# EAGLE design R220J (EAGLE 6.6.0)
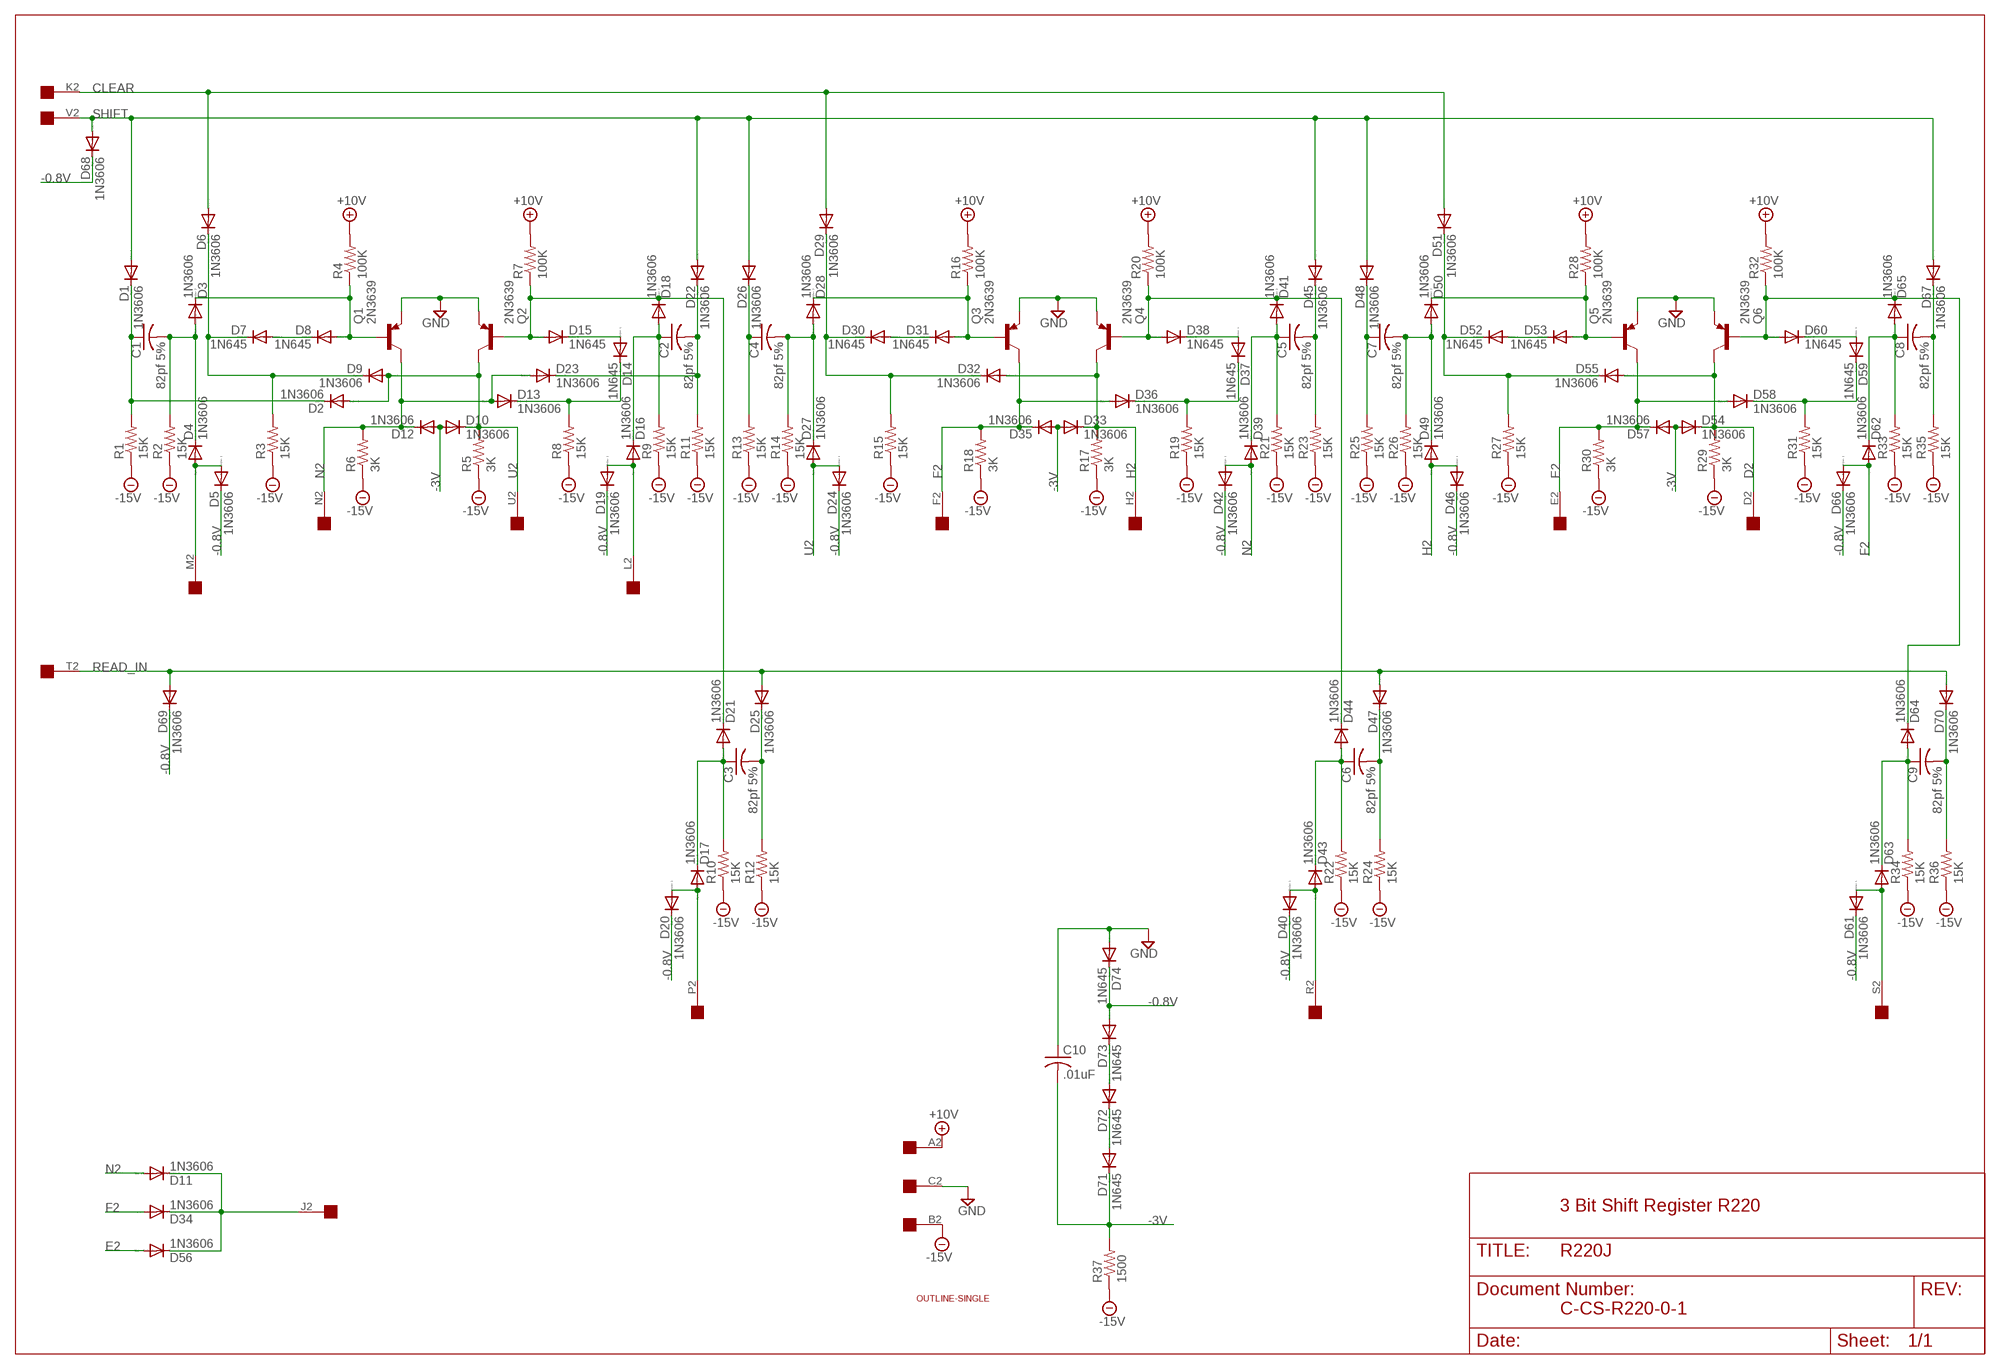
[diagram p0: schematic, sheet 1]

## Parts
C1  82pf 5%  C-US050-025X075  [C050-025X075]
C2  82pf 5%  C-US050-025X075  [C050-025X075]
C3  82pf 5%  C-US050-025X075  [C050-025X075]
C4  82pf 5%  C-US050-025X075  [C050-025X075]
C5  82pf 5%  C-US050-025X075  [C050-025X075]
C6  82pf 5%  C-US050-025X075  [C050-025X075]
C7  82pf 5%  C-US050-025X075  [C050-025X075]
C8  82pf 5%  C-US050-025X075  [C050-025X075]
C9  82pf 5%  C-US050-025X075  [C050-025X075]
C10  .01uF  C-US050-025X075  [C050-025X075]
D1  1N3606  1N4148DO35-10  [DO35-10]
D2  1N3606  1N4148DO35-10  [DO35-10]
D3  1N3606  1N4148DO35-10  [DO35-10]
D4  1N3606  1N4148DO35-10  [DO35-10]
D5  1N3606  1N4148DO35-10  [DO35-10]
D6  1N3606  1N4148DO35-10  [DO35-10]
D7  1N645  1N4148DO35-10  [DO35-10]
D8  1N645  1N4148DO35-10  [DO35-10]
D9  1N3606  1N4148DO35-10  [DO35-10]
D10  1N3606  1N4148DO35-10  [DO35-10]
D11  1N3606  1N4148DO35-10  [DO35-10]
D12  1N3606  1N4148DO35-10  [DO35-10]
D13  1N3606  1N4148DO35-10  [DO35-10]
D14  1N645  1N4148DO35-10  [DO35-10]
D15  1N645  1N4148DO35-10  [DO35-10]
D16  1N3606  1N4148DO35-10  [DO35-10]
D17  1N3606  1N4148DO35-10  [DO35-10]
D18  1N3606  1N4148DO35-10  [DO35-10]
D19  1N3606  1N4148DO35-10  [DO35-10]
D20  1N3606  1N4148DO35-10  [DO35-10]
D21  1N3606  1N4148DO35-10  [DO35-10]
D22  1N3606  1N4148DO35-10  [DO35-10]
D23  1N3606  1N4148DO35-10  [DO35-10]
D24  1N3606  1N4148DO35-10  [DO35-10]
D25  1N3606  1N4148DO35-10  [DO35-10]
D26  1N3606  1N4148DO35-10  [DO35-10]
D27  1N3606  1N4148DO35-10  [DO35-10]
D28  1N3606  1N4148DO35-10  [DO35-10]
D29  1N3606  1N4148DO35-10  [DO35-10]
D30  1N645  1N4148DO35-10  [DO35-10]
D31  1N645  1N4148DO35-10  [DO35-10]
D32  1N3606  1N4148DO35-10  [DO35-10]
D33  1N3606  1N4148DO35-10  [DO35-10]
D34  1N3606  1N4148DO35-10  [DO35-10]
D35  1N3606  1N4148DO35-10  [DO35-10]
D36  1N3606  1N4148DO35-10  [DO35-10]
D37  1N645  1N4148DO35-10  [DO35-10]
D38  1N645  1N4148DO35-10  [DO35-10]
D39  1N3606  1N4148DO35-10  [DO35-10]
D40  1N3606  1N4148DO35-10  [DO35-10]
D41  1N3606  1N4148DO35-10  [DO35-10]
D42  1N3606  1N4148DO35-10  [DO35-10]
D43  1N3606  1N4148DO35-10  [DO35-10]
D44  1N3606  1N4148DO35-10  [DO35-10]
D45  1N3606  1N4148DO35-10  [DO35-10]
D46  1N3606  1N4148DO35-10  [DO35-10]
D47  1N3606  1N4148DO35-10  [DO35-10]
D48  1N3606  1N4148DO35-10  [DO35-10]
D49  1N3606  1N4148DO35-10  [DO35-10]
D50  1N3606  1N4148DO35-10  [DO35-10]
D51  1N3606  1N4148DO35-10  [DO35-10]
D52  1N645  1N4148DO35-10  [DO35-10]
D53  1N645  1N4148DO35-10  [DO35-10]
D54  1N3606  1N4148DO35-10  [DO35-10]
D55  1N3606  1N4148DO35-10  [DO35-10]
D56  1N3606  1N4148DO35-10  [DO35-10]
D57  1N3606  1N4148DO35-10  [DO35-10]
D58  1N3606  1N4148DO35-10  [DO35-10]
D59  1N645  1N4148DO35-10  [DO35-10]
D60  1N645  1N4148DO35-10  [DO35-10]
D61  1N3606  1N4148DO35-10  [DO35-10]
D62  1N3606  1N4148DO35-10  [DO35-10]
D63  1N3606  1N4148DO35-10  [DO35-10]
D64  1N3606  1N4148DO35-10  [DO35-10]
D65  1N3606  1N4148DO35-10  [DO35-10]
D66  1N3606  1N4148DO35-10  [DO35-10]
D67  1N3606  1N4148DO35-10  [DO35-10]
D68  1N3606  1N4148DO35-10  [DO35-10]
D69  1N3606  1N4148DO35-10  [DO35-10]
D70  1N3606  1N4148DO35-10  [DO35-10]
D71  1N645  1N4148DO35-10  [DO35-10]
D72  1N645  1N4148DO35-10  [DO35-10]
D73  1N645  1N4148DO35-10  [DO35-10]
D74  1N645  1N4148DO35-10  [DO35-10]
Q1  2N3639  2N3637  [TO39]
Q2  2N3639  2N3637  [TO39]
Q3  2N3639  2N3637  [TO39]
Q4  2N3639  2N3637  [TO39]
Q5  2N3639  2N3637  [TO39]
Q6  2N3639  2N3637  [TO39]
R1  15K  R-US_0207/10  [0207/10]
R2  15K  R-US_0207/10  [0207/10]
R3  15K  R-US_0207/10  [0207/10]
R4  100K  R-US_0207/10  [0207/10]
R5  3K  R-US_0207/10  [0207/10]
R6  3K  R-US_0207/10  [0207/10]
R7  100K  R-US_0207/10  [0207/10]
R8  15K  R-US_0207/10  [0207/10]
R9  15K  R-US_0207/10  [0207/10]
R10  15K  R-US_0207/10  [0207/10]
R11  15K  R-US_0207/10  [0207/10]
R12  15K  R-US_0207/10  [0207/10]
R13  15K  R-US_0207/10  [0207/10]
R14  15K  R-US_0207/10  [0207/10]
R15  15K  R-US_0207/10  [0207/10]
R16  100K  R-US_0207/10  [0207/10]
R17  3K  R-US_0207/10  [0207/10]
R18  3K  R-US_0207/10  [0207/10]
R19  15K  R-US_0207/10  [0207/10]
R20  100K  R-US_0207/10  [0207/10]
R21  15K  R-US_0207/10  [0207/10]
R22  15K  R-US_0207/10  [0207/10]
R23  15K  R-US_0207/10  [0207/10]
R24  15K  R-US_0207/10  [0207/10]
R25  15K  R-US_0207/10  [0207/10]
R26  15K  R-US_0207/10  [0207/10]
R27  15K  R-US_0207/10  [0207/10]
R28  100K  R-US_0207/10  [0207/10]
R29  3K  R-US_0207/10  [0207/10]
R30  3K  R-US_0207/10  [0207/10]
R31  15K  R-US_0207/10  [0207/10]
R32  100K  R-US_0207/10  [0207/10]
R33  15K  R-US_0207/10  [0207/10]
R34  15K  R-US_0207/10  [0207/10]
R35  15K  R-US_0207/10  [0207/10]
R36  15K  R-US_0207/10  [0207/10]
R37  1500  R-US_0207/10  [0207/10]
U$1  OUTLINE-SINGLE  [SINGLE]
U$2  EDGE-1  [EDGE-CON1]

## Nets
+10V [Power]: R4.2 R7.2 R16.2 R20.2 R28.2 R32.2 U$2.A2
-0.8V [Power]: D5.C D19.C D20.C D24.C D40.C D42.C D46.C D61.C D66.C D68.C D69.C D73.A D74.C
-3V [Power]: C10.2 D10.A D12.A D33.A D35.A D54.A D57.A D71.C R37.2
-15V [Power]: R1.1 R2.1 R3.1 R5.1 R6.1 R8.1 R9.1 R10.1 R11.1 R12.1 R13.1 R14.1 R15.1 R17.1 R18.1 R19.1 R21.1 R22.1 R23.1 R24.1 R25.1 R26.1 R27.1 R29.1 R30.1 R31.1 R33.1 R34.1 R35.1 R36.1 R37.1 U$2.B2
CLEAR: D6.A D29.A D51.A U$2.K2
D2: D54.C D55.A Q6.3(C) R29.2 U$2.D2
E2: D56.A D57.C D58.A Q5.3(C) R30.2 U$2.E2
F2: D34.A D35.C D36.A D62.A D66.A Q3.3(C) R18.2 U$2.F2
GND [Power]: C10.1 D74.A Q1.1(E) Q2.1(E) Q3.1(E) Q4.1(E) Q5.1(E) Q6.1(E) U$2.C2
H2: D32.A D33.C D46.A D49.A Q4.3(C) R17.2 U$2.H2
N2: D11.A D12.C D13.A D23.A D39.A D42.A Q1.3(C) R6.2 U$2.N2
N$1: D30.A D31.C
N$2: C2.2 D22.C D23.C R11.2
N$3: D29.C D30.C D32.C R15.2
N$4: C1.1 D1.C D2.C R1.2
N$6: D14.A D15.C
N$7: C1.2 D3.A D4.C R2.2
N$8: C2.1 D16.C D18.A R9.2
N$9: D6.C D7.C D9.C R3.2
N$10: D4.A D5.A U$2.M2
N$11: D28.C D31.A Q3.2(B) R16.1
N$12: D13.C D14.C R8.2
N$13: D37.A D38.C
N$14: D3.C D8.A Q1.2(B) R4.1
N$15: D38.A D41.C D44.C Q4.2(B) R20.1
N$16: D36.C D37.C R19.2
N$17: D15.A D18.C D21.C Q2.2(B) R7.1
N$18: C4.1 D26.C R13.2
N$19: C4.2 D27.C D28.A R14.2
N$22: C5.1 D39.C D41.A R21.2
N$23: D7.A D8.C
N$24: D11.C D34.C D56.C U$2.J2
N$25: C5.2 D45.C R23.2
N$27: D52.A D53.C
N$28: D51.C D52.C D55.C R27.2
N$29: D50.C D53.A Q5.2(B) R28.1
N$30: D59.A D60.C
N$31: D60.A D64.C D65.C Q6.2(B) R32.1
N$32: D16.A D19.A U$2.L2
N$33: D58.C D59.C R31.2
N$34: C7.1 D48.C R25.2
N$35: C7.2 D49.C D50.A R26.2
N$36: D71.A D72.C
N$39: C8.1 D62.C D65.A R33.2
N$40: C8.2 D67.C R35.2
N$41: D72.A D73.C
N$43: C3.1 D17.C D21.A R10.2
N$44: C3.2 D25.C R12.2
N$46: C6.1 D43.C D44.A R22.2
N$47: C6.2 D47.C R24.2
N$50: C9.1 D63.C D64.A R34.2
N$51: C9.2 D70.C R36.2
P2: D17.A D20.A U$2.P2
R2: D40.A D43.A U$2.R2
READ_IN: D25.A D47.A D69.A D70.A U$2.T2
S2: D61.A D63.A U$2.S2
SHIFT: D1.A D22.A D26.A D45.A D48.A D67.A D68.A U$2.V2
U2: D2.A D9.A D10.C D24.A D27.A Q2.3(C) R5.2 U$2.U2

## Notes on the sheet
- 3 Bit Shift Register R220
- C-CS-R220-0-1

## Library data of the parts
C1-C10 = rcl:C-US: CAPACITOR, American symbol
D1-D74 = diode:1N4148: DIODE high speed (Philips)
Q1-Q6 = transistor-pnp:2N3637*: PNP Transistror
R1-R37 = rcl:R-US_: RESISTOR, American symbol
U$1 = dec-con:OUTLINE-*: Board outlines for DEC boards.
U$2 = dec-con:EDGE-1: Single-Sided DEC Edge Connector -- (side 2)

## Net classes
1 Power: width 0.813 mm

## Board
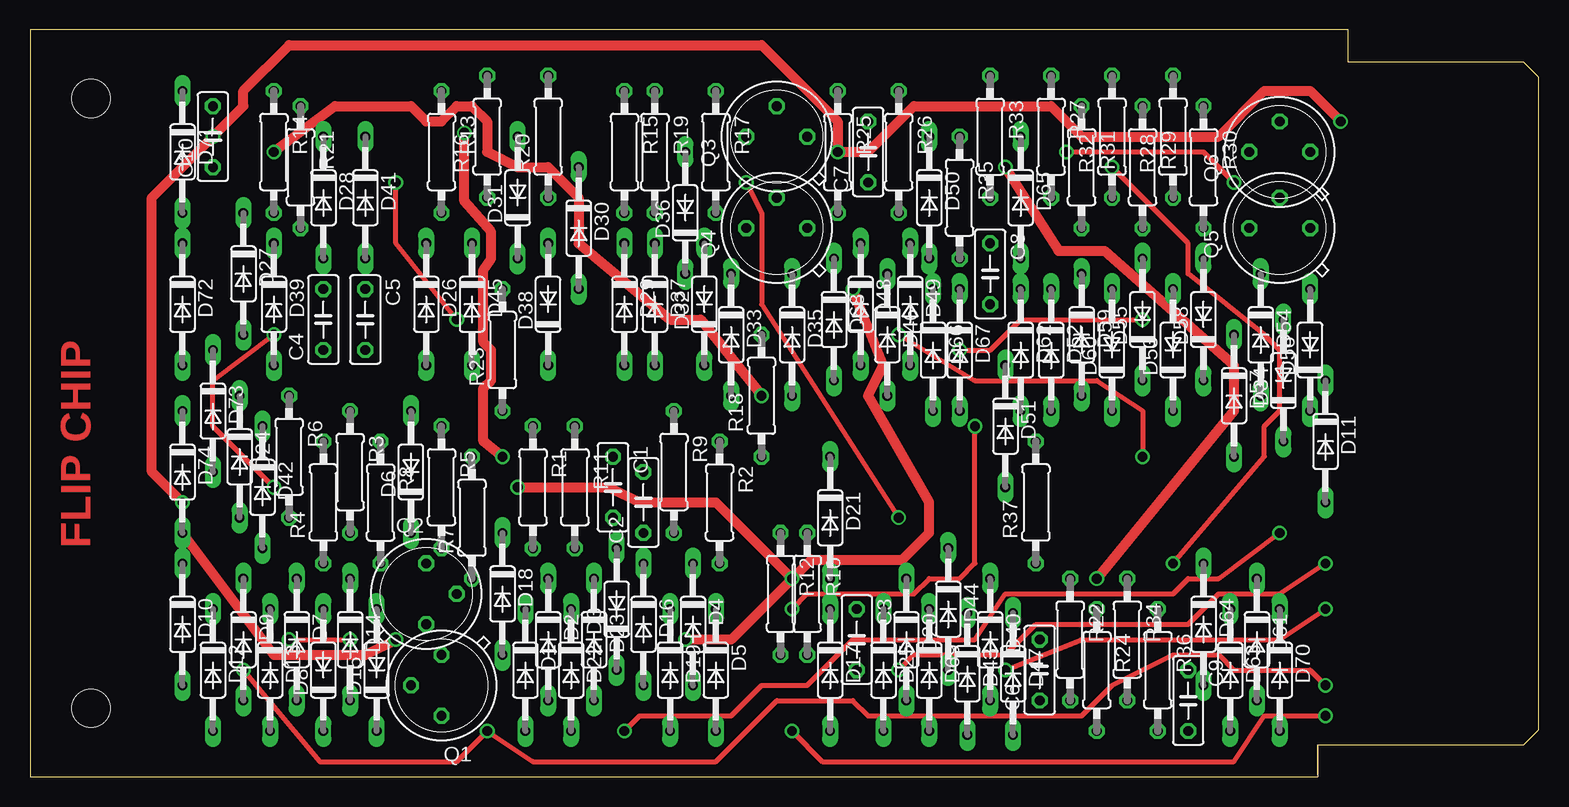
[diagram p1: board, top side]
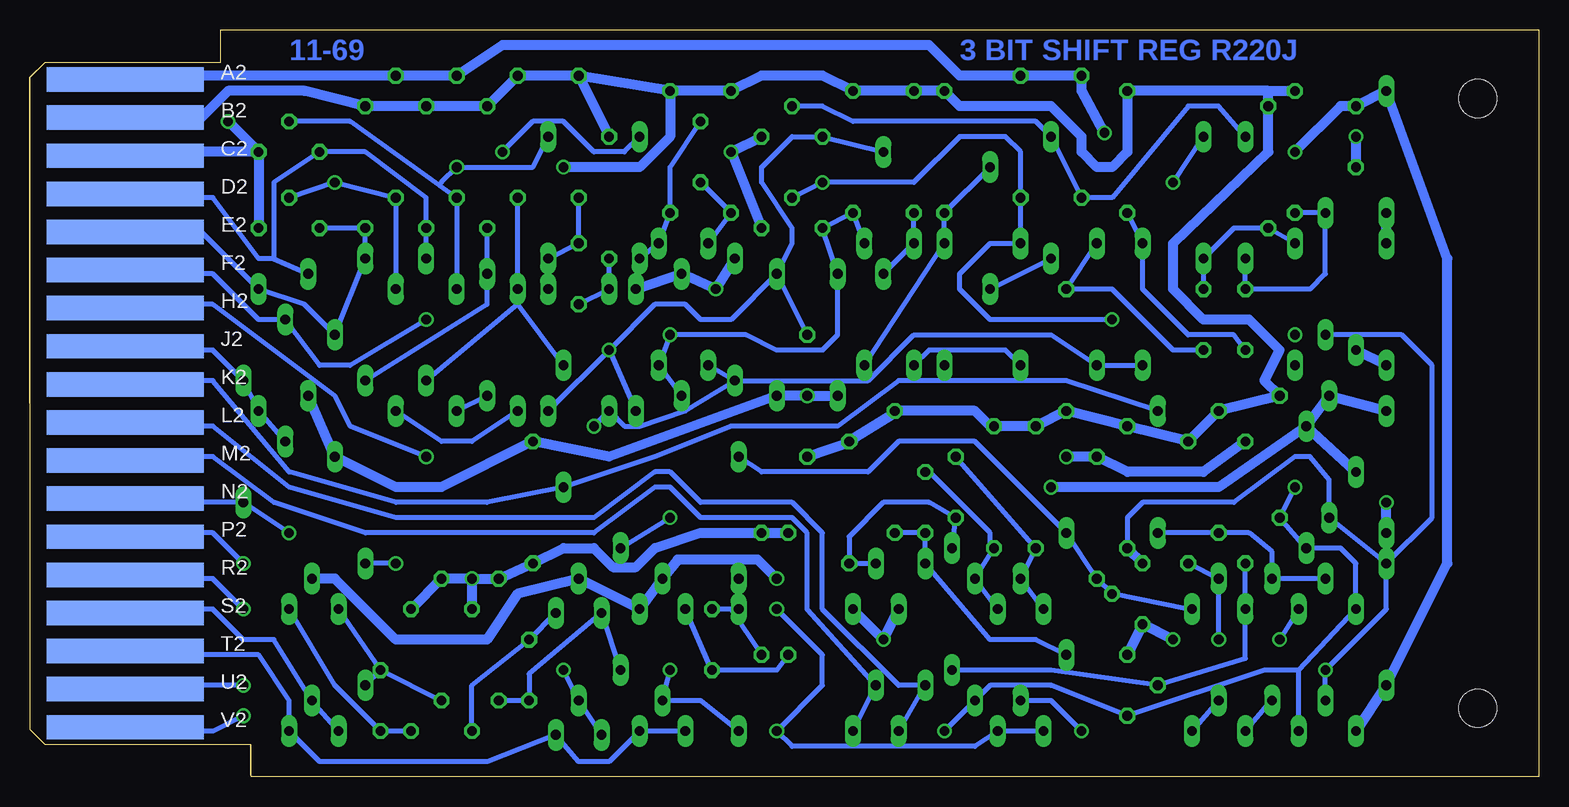
[diagram p2: board, bottom side, seen from below]

Size 125.73 x 62.23 mm. Coordinates in mm from the lower left corner, seen from the top.
Copper layers (1+16): Top 0.035mm / dielectric 1.5mm / Bottom 0.035mm
Design rules "16mils": minimum track width 16mil, minimum drill 32mil, track to track 15mil, track to pad 10mil, pad to pad 10mil, via to via 10mil, smd to smd 10mil, copper to edge 13mil, drill to drill 10mil, minimum pad ring 10mil, minimum via ring 8mil, stop-mask expansion 0mil, vias tented up to drill 0mil, thermal gap 10mil

### Footprints (pad centres in the part's own frame; a part is rotated, then mirrored left to right if it is on the bottom)
C050-025X075 = drill 0.813 octagon: 1 -2.54,0; 2 2.54,0
DO35-10 = drill 0.813 long: A 5.08,0; C -5.08,0
TO39 = drill 0.813 octagon: 1 0,-2.54; 2 2.54,0; 3 0,2.54
0207/10 = drill 0.813 octagon: 1 -5.08,0; 2 5.08,0
SINGLE = hole 3.175: 120.65,56.515; 120.65,5.715
EDGE-CON1 = smd 13.106 x 2.032 bottom: A2 7.938,4.128; B2 7.938,7.303; C2 7.938,10.477; D2 7.938,13.652; E2 7.938,16.828; F2 7.938,20.003; H2 7.938,23.177; J2 7.938,26.352; K2 7.938,29.527; L2 7.938,32.703; M2 7.938,35.877; N2 7.938,39.053; P2 7.938,42.227; R2 7.938,45.403; S2 7.938,48.578; T2 7.938,51.752; U2 7.938,54.928; V2 7.938,58.102

### Placement (x,y rotation side)
C1  48.58,24.13 270 top
C2  51.12,22.86 90 top
C3  68.9,11.43 270 top
C4  24.45,38.1 90 top
C5  27.94,38.1 270 top
C6  84.14,8.89 90 top
C7  69.85,52.07 90 top
C8  80.01,41.91 270 top
C9  96.52,6.35 270 top
C10  15.24,53.34 90 top
D1  41.27,8.89 270 top
D2  43.18,11.43 270 top
D3  48.9,13.97 90 top
D4  55.24,12.7 270 top
D5  57.15,8.89 270 top
D6  31.75,25.4 90 top
D7  22.23,11.43 270 top
D8  24.45,8.89 90 top
D9  17.78,11.43 270 top
D10  12.7,12.7 270 top
D11  107.95,27.94 270 top
D12  15.24,8.89 270 top
D13  20,8.89 270 top
D14  26.67,11.43 270 top
D15  28.89,8.89 90 top
D16  51.12,12.7 270 top
D17  66.67,8.89 270 top
D18  39.37,15.24 270 top
D19  53.34,8.89 270 top
D20  73.03,11.43 270 top
D21  66.67,21.59 270 top
D22  45.09,8.89 270 top
D23  46.99,11.43 270 top
D24  17.46,26.67 270 top
D25  71.12,8.89 270 top
D26  33.02,39.37 270 top
D27  17.78,41.91 270 top
D28  24.45,48.26 270 top
D29  49.53,39.37 270 top
D30  45.72,45.72 270 top
D31  40.64,48.26 90 top
D32  56.2,39.37 90 top
D33  58.42,36.83 270 top
D34  104.46,33.02 90 top
D35  63.5,36.83 270 top
D36  54.61,46.99 90 top
D37  52.07,39.37 270 top
D38  43.18,39.37 90 top
D39  20.32,39.37 270 top
D40  80.01,11.43 270 top
D41  27.94,48.26 270 top
D42  19.37,24.13 270 top
D43  78.11,8.57 270 top
D44  76.52,13.97 270 top
D45  36.83,39.37 270 top
D46  71.44,36.83 270 top
D47  81.92,8.57 270 top
D48  69.22,39.37 270 top
D49  73.34,39.37 270 top
D50  74.93,48.26 270 top
D51  81.28,29.21 270 top
D52  85.09,35.56 270 top
D53  95.25,35.56 90 top
D54  102.55,36.83 270 top
D55  92.71,38.1 90 top
D56  106.68,35.56 90 top
D57  100.33,31.75 270 top
D58  97.79,38.1 90 top
D59  87.63,36.83 270 top
D60  90.17,35.56 90 top
D61  102.23,11.43 270 top
D62  82.55,35.56 270 top
D63  100.01,8.89 270 top
D64  97.79,12.7 270 top
D65  82.55,48.26 270 top
D66  75.25,35.56 270 top
D67  77.47,35.56 270 top
D68  66.99,38.1 270 top
D69  74.93,8.89 270 top
D70  104.14,8.89 270 top
D71  12.7,52.07 270 top
D72  12.7,39.37 270 top
D73  15.24,30.48 270 top
D74  12.7,25.4 270 top
Q1  34.29,7.62 180 top
Q2  33.02,15.24 0 top
Q3  62.23,53.34 90 top
Q4  62.23,45.72 90 top
Q5  104.14,45.72 90 top
Q6  104.14,52.07 90 top
R1  41.91,24.13 270 top
R2  57.47,22.86 270 top
R3  26.67,25.4 270 top
R4  24.45,22.86 90 top
R5  34.29,24.13 270 top
R6  21.59,26.67 270 top
R7  36.83,21.59 90 top
R8  29.21,22.86 270 top
R9  53.66,25.4 270 top
R10  64.77,15.24 270 top
R11  45.4,24.13 270 top
R12  62.55,15.24 270 top
R13  34.29,52.07 270 top
R14  20.32,52.07 270 top
R15  49.53,52.07 270 top
R16  38.1,53.34 90 top
R17  57.15,52.07 270 top
R18  60.96,31.75 90 top
R19  52.07,52.07 270 top
R20  43.18,53.34 90 top
R21  22.54,50.8 270 top
R22  86.68,11.43 270 top
R23  39.37,35.56 90 top
R24  88.9,8.89 270 top
R25  67.31,52.07 270 top
R26  72.39,52.07 270 top
R27  85.09,53.34 270 top
R28  95.25,53.34 90 top
R29  92.71,50.8 270 top
R30  97.79,50.8 270 top
R31  87.63,50.8 270 top
R32  90.17,53.34 90 top
R33  80.01,53.34 270 top
R34  91.44,11.43 270 top
R35  77.47,48.26 270 top
R36  93.98,8.89 270 top
R37  83.82,22.86 90 top
U$1  125.73,62.23 180 top
U$2  125.73,62.23 180 top
U$3  [FLIPCHIP]  0,0 0 top

### Tracks (layer width: path | path; a pad name or v marks a point on that pad's centre or on a via)
+10V  (via drill 0.81)
  Top 0.813: v36.2,53.66 36.2,47.94 38.42,45.4 38.42,43.18 37.78,42.23 37.78,36.2 38.42,35.56 38.42,33.02 37.78,32.38 37.78,27.94 v39.37,26.67
  Bottom 0.813: U$2.A2 116.84,58.04 116.84,58.42 R28.2 R32.2 86.36,60.96 50.8,60.96 48.26,58.42 R20.2 R16.2 38.1,57.15 v36.2,53.66 | R4.2 27.94,25.4 34.29,25.4 R7.2 v39.37,26.67
-0.8V  (via drill 0.81)
  Top 0.813: v68.58,40.64 71.12,34.29 69.85,31.75 74.93,22.86 74.93,20.32 72.71,18.1 65.09,18.1 v63.5,16.51 | v54.61,11.43 58.42,11.43 v63.5,16.51 | v40.64,24.13 48.26,24.13 50.8,22.86 57.15,22.86 v63.5,16.51
  Bottom 0.813: v40.64,24.13 26.67,24.13 D42.C | D19.C v54.61,11.43 D5.C | D68.C v68.58,40.64 D46.C D66.C | D61.C 100.33,16.51 95.25,11.43 87.63,11.43 85.09,15.24 D40.C D69.C D20.C 71.75,18.1 65.09,18.1 v63.5,16.51 | D73.A D42.C | D42.C D24.C D74.C
-3V  (via drill 0.81)
  Top 0.813: v20.32,52.07 25.4,55.88 31.75,55.88 33.02,54.61 34.29,54.61 35.56,55.88 36.83,55.88 38.1,54.61 38.1,52.07 40.64,50.8 43.18,50.8 45.72,48.26 45.72,44.45 53.34,38.1 55.88,38.1 v60.96,31.75
  Bottom 0.813: D54.A D57.A 95.25,24.13 91.44,24.13 R37.2 77.47,26.67 D35.A v60.96,31.75 D33.A | v20.32,52.07 16.51,55.88 C10.2 D71.C 7.62,43.18 7.62,17.78 D10.A D12.A
-15V  (via drill 0.81)
  Top 0.813: v81.28,50.8 85.72,43.81 89.53,43.81 100.33,34.29 100.33,30.48 v88.9,16.51
  Bottom 0.813: U$2.B2 117.13,54.9 116.84,54.61 111.76,54.61 109.22,57.15 102.87,57.15 R30.1 R29.1 R31.1 R27.1 R33.1 | R33.1 R35.1 | v81.28,50.8 74.93,50.8 72.39,53.34 R26.1 | R26.1 R25.1 64.77,58.42 59.69,58.42 R17.1 R19.1 R15.1 48.26,55.88 40.64,55.88 38.1,53.34 38.1,52.07 36.83,50.8 35.56,50.8 34.29,52.07 R13.1 22.54,57.15 | R26.1 R33.1 | v88.9,16.51 R34.1 R36.1 | v88.9,16.51 R24.1 | v88.9,16.51 R22.1 R37.1 81.28,19.05 78.74,19.05 77.15,17.46 75.25,17.46 73.66,19.05 69.85,20.32 R10.1 R12.1 | 22.54,57.15 R21.1 22.54,52.07 30.48,44.45 30.48,40.64 27.94,38.1 24.13,38.1 21.59,35.56 22.86,33.02 R6.1 R3.1 R8.1 R5.1 R23.1 R1.1 R11.1 45.72,29.21 46.99,30.48 R9.1 53.34,30.48 R2.1 57.15,27.94 R18.1 | 22.54,57.15 R14.1
CLEAR
  Bottom 0.406: U$2.K2 116.84,33.02 110.49,33.02 104.14,25.4 95.25,22.86 87.63,22.86 D51.A 73.66,26.67 67.31,29.21 58.42,29.21 53.34,33.02 49.53,33.02 | D6.A 39.37,33.02 49.53,33.02 | 49.53,33.02 D29.A
D2
  Bottom 0.406: U$2.D2 117.14,48.56 116.84,48.26 110.49,48.26 106.68,43.18 105.41,43.18 | 105.41,43.18 105.41,49.53 Q6.3 97.79,52.07 92.71,48.26 R29.2 D55.A | 105.41,43.18 D54.C
E2
  Bottom 0.406: U$2.E2 117.17,45.39 116.84,45.72 111.76,45.72 D56.A 102.87,39.37 D57.C D58.A R30.2 Q5.3
F2  (via drill 0.81)
  Top 0.406: v92.71,38.1 82.55,38.1 80.01,35.56 v77.47,35.56
  Bottom 0.406: U$2.F2 116.84,41.91 110.49,41.91 106.68,38.1 D34.A 101.6,34.29 99.06,34.29 v92.71,38.1 | D36.A Q3.3 62.23,53.34 64.77,50.8 64.77,49.53 62.23,45.72 62.23,44.45 D35.C | R18.2 D35.C | D35.C 67.31,38.1 69.85,38.1 71.12,39.37 73.66,39.37 v77.47,35.56 | v77.47,35.56 D66.A | v77.47,35.56 D62.A
GND  (via drill 0.81)
  Top 0.813: v109.22,54.61 106.68,57.15 102.87,57.15 99.06,53.34 87.63,53.34 85.09,55.88 73.66,55.88 69.85,52.07 v67.31,52.07 67.31,54.61 60.96,60.96 21.59,60.96 17.78,57.15 17.78,55.88 v15.24,53.34 10.16,48.26 10.16,25.4 v12.7,22.86 | D74.A 20.32,10.16 27.94,10.16 v30.48,11.43
  Bottom 0.813: U$2.C2 117.17,51.74 116.84,52.07 Q6.1 | Q6.1 Q5.1 | v109.22,54.61 Q6.1 | Q3.1 v67.31,52.07 Q4.1 | v15.24,53.34 C10.1 | D74.A v12.7,22.86 | Q1.1 Q2.1 v30.48,11.43
H2  (via drill 0.81)
  Top 0.406: v72.39,36.83 78.74,33.02 88.9,33.02 92.71,30.48 v92.71,26.67
  Bottom 0.406: U$2.H2 115.57,39.37 110.49,39.37 100.33,31.75 99.06,29.21 v92.71,26.67 | D32.A R17.2 Q4.3 D33.C 58.42,36.83 59.69,35.56 63.5,35.56 66.04,36.83 v72.39,36.83 D49.A D46.A
N2  (via drill 0.81)
  Top 0.406: v104.14,20.32 99.06,16.51 96.52,16.51 95.25,15.24 81.28,15.24 78.74,11.43 68.58,11.43 64.77,7.62 60.96,7.62 58.42,5.08 50.8,5.08 v49.53,3.81 | v20.32,24.13 15.24,29.21 15.24,33.02 v20.32,36.83 D39.A
  Bottom 0.406: U$2.N2 116.84,22.86 D11.A v104.14,20.32 | 20,8.89 D12.C 15.24,17.78 16.51,19.05 D42.A R6.2 v20.32,24.13 | v49.53,3.81 D23.A 45.72,7.62 40.64,7.62 Q1.3 22.86,8.89 20,8.89 | D13.A 20,8.89
N$1
  Bottom 0.406: D31.C D30.A
N$2
  Bottom 0.406: C2.2 50.8,25.4 45.72,20.32 45.72,19.05 R11.2 D23.C D22.C
N$3
  Bottom 0.406: D30.C R15.2 D29.C D32.C
N$4
  Bottom 0.406: C1.1 R1.2 D2.C D1.C
N$6
  Bottom 0.406: D15.C D14.A
N$7
  Bottom 0.406: D4.C R2.2 57.47,20 54.61,22.86 50.8,22.86 C1.2 D3.A
N$8
  Bottom 0.406: C2.1 50.8,20.32 | C2.1 R9.2 | C2.1 D16.C 45.72,11.43 41.91,11.43 D18.A
N$9
  Bottom 0.406: D9.C D7.C 22.23,18.73 24.13,20.32 R3.2 D6.C
N$10
  Bottom 0.406: U$2.M2 116.84,26.67 110.49,26.67 105.41,22.86 97.79,20.32 78.74,20.32 73.66,24.13 72.39,24.13 69.85,21.59 62.23,21.59 60.96,20.32 60.96,13.97 D4.A D5.A
N$11
  Bottom 0.406: Q3.2 59.69,55.88 57.15,54.61 41.91,54.61 D31.A R16.1 35.56,48.26 29.21,55.88 26.67,55.88 D28.C
N$12  (via drill 0.81)
  Top 0.406: v21.59,11.43 v26.67,11.43
  Bottom 0.406: R8.2 D14.C v26.67,11.43 | D13.C v21.59,11.43
N$13
  Bottom 0.406: D38.C 44.45,35.56 50.8,35.56 D37.A
N$14
  Bottom 0.406: D3.C 40.64,8.89 Q1.2 24.45,9.84 D8.A R4.1
N$15  (via drill 0.81)
  Top 0.406: v72.39,21.59 60.96,39.37 60.96,46.99 v59.69,49.53 | v35.56,38.1 30.48,44.45 v30.48,49.53
  Bottom 0.406: Q4.2 v59.69,49.53 52.07,49.53 48.26,53.34 44.45,53.34 43.18,52.07 R20.1 D38.A 45.72,44.45 48.26,41.91 48.26,40.64 45.72,38.1 v35.56,38.1 | v72.39,21.59 D44.C | v30.48,49.53 D41.C
N$16
  Bottom 0.406: D36.C D37.C R19.2
N$17
  Bottom 0.406: D15.A 29.21,13.97 Q2.2 R7.1 D18.C 46.99,27.94 53.34,27.94 55.88,25.4 64.77,25.4 D21.C
N$18
  Bottom 0.406: C4.1 25.4,36.83 29.21,36.83 33.02,40.64 D26.C R13.2
N$19
  Bottom 0.406: R14.2 D27.C 17.78,41.91 19.05,40.64 C4.2 D28.A
N$22
  Bottom 0.406: C5.1 D41.A 25.4,45.72 R21.2 D39.C
N$23
  Bottom 0.406: D7.A 22.54,6.03 D8.C
N$24
  Bottom 0.406: U$2.J2 116.84,35.56 110.49,35.56 D11.C D56.C D34.C
N$25
  Bottom 0.406: C5.2 30.48,35.56 35.56,40.64 R23.2 D45.C
N$27
  Bottom 0.406: D52.A 88.9,27.94 91.44,27.94 D53.C
N$28
  Bottom 0.406: R27.2 D52.C 85.09,39.37 | 85.09,39.37 D55.C | D51.C 85.09,39.37
N$29  (via drill 0.81)
  Top 0.406: v100.33,49.53 97.79,52.07 v86.36,52.07
  Bottom 0.406: Q5.2 v100.33,49.53 R28.1 D53.A | v86.36,52.07 83.82,54.61 81.28,54.61 78.74,52.07 76.2,52.07 D50.C
N$30
  Bottom 0.406: D59.A D60.C
N$31  (via drill 0.81)
  Top 0.406: v90.17,50.8 96.52,44.45 96.52,41.91 102.87,36.83 104.14,35.56 104.14,30.48 102.87,29.21 102.87,26.67 v95.25,17.78
  Bottom 0.406: Q6.2 99.06,54.61 91.61,49.29 | 91.61,49.29 R32.1 D60.A | D65.C 83.82,50.8 v90.17,50.8 91.44,49.53 91.61,49.29 | v95.25,17.78 D64.C
N$32
  Bottom 0.406: U$2.L2 116.84,29.21 110.49,29.21 104.14,24.13 95.25,21.59 78.74,21.59 73.66,25.4 72.39,25.4 69.85,22.86 62.23,22.86 59.69,20.32 59.69,13.97 53.34,7.62 D16.A D19.A
N$33
  Bottom 0.406: D58.C 87.63,39.37 D59.C R31.2
N$34
  Bottom 0.406: C7.1 R25.2 D48.C
N$35
  Bottom 0.406: C7.2 72.39,50.8 R26.2 D49.C D50.A
N$36
  Bottom 0.813: D72.C D71.A
N$39
  Bottom 0.406: R33.2 C8.1 D65.A D62.C
N$40
  Bottom 0.406: R35.2 D67.C C8.2
N$41
  Bottom 0.813: D72.A D73.C
N$43
  Bottom 0.406: 67.31,13.97 D17.C D21.A | R10.2 67.31,13.97 | 67.31,13.97 C3.1
N$44
  Bottom 0.406: D25.C C3.2 63.5,8.89 R12.2
N$46
  Bottom 0.406: R22.2 C6.1 84.14,8.57 D43.C D44.A
N$47
  Bottom 0.406: R24.2 88.9,7.62 C6.2 D47.C
N$50
  Bottom 0.406: C9.1 D64.A | R34.2 C9.1 | C9.1 D63.C
N$51
  Bottom 0.406: R36.2 C9.2 100.33,7.62 D70.C
P2  (via drill 0.81)
  Top 0.406: v107.95,17.78 104.14,15.24 99.06,15.24 96.52,12.7 83.82,12.7 81.28,10.16 73.66,10.16 v72.39,8.89
  Bottom 0.406: U$2.P2 116.84,20.32 110.49,20.32 v107.95,17.78 | v72.39,8.89 D20.A 69.85,6.35 D17.A
R2  (via drill 0.81)
  Top 0.406: v107.95,13.97 104.14,11.43 87.63,11.43 v81.28,8.89
  Bottom 0.406: U$2.R2 115.57,16.51 110.49,16.51 v107.95,13.97 | v81.28,8.89 D40.A D43.A
READ_IN
  Bottom 0.406: U$2.T2 116.84,10.16 106.68,10.16 104.14,6.35 D70.A 101.6,1.27 87.63,1.27 D47.A 80.01,1.27 77.47,1.27 D69.A D25.A
S2
  Bottom 0.406: U$2.S2 116.84,13.97 110.49,13.97 107.95,11.43 105.41,11.43 D61.A D63.A
SHIFT  (via drill 0.81)
  Top 0.406: v107.95,5.08 102.87,5.08 100.33,1.27 66.04,1.27 v63.5,3.81 | v63.5,13.97 64.77,15.24 73.66,15.24 74.93,16.51 77.47,16.51 78.74,17.78 v78.74,29.21
  Bottom 0.406: U$2.V2 116.84,3.81 110.49,3.81 v107.95,5.08 | D1.A D22.A 46.99,2.54 62.23,2.54 v63.5,3.81 59.69,7.62 59.69,10.16 v63.5,13.97 | v78.74,29.21 D67.A 76.2,29.21 74.93,29.21 71.12,30.48 D68.A | D68.A D48.A | D68.A 55.88,33.02 52.07,36.83 40.64,36.83 D45.A D26.A
U2  (via drill 0.81)
  Top 0.406: v107.95,7.62 106.68,8.89 100.33,8.89 99.06,10.16 95.25,10.16 90.17,7.62 87.63,5.08 69.85,5.08 68.58,6.35 62.23,6.35 57.15,1.27 41.91,1.27 v38.1,3.81 35.56,1.27 24.13,1.27 v17.78,8.89
  Bottom 0.406: U$2.U2 116.84,7.62 v107.95,7.62 | D10.C D24.A 17.46,24.77 19.05,26.67 20.32,26.67 25.4,22.86 33.02,22.86 34.29,21.59 R5.2 | D2.A 40.64,6.35 v38.1,3.81 | D9.A v17.78,8.89 12.7,13.97 D10.C | D10.C 8.89,21.59 8.89,34.29 11.43,36.83 D27.A
  Bottom 0.813: R5.2 Q2.3

### Text on the board
Bottom: 3 BIT SHIFT REG R220J | 11-69